# EAGLE design TRV_SX1231_V0.1b (EAGLE 6.3)
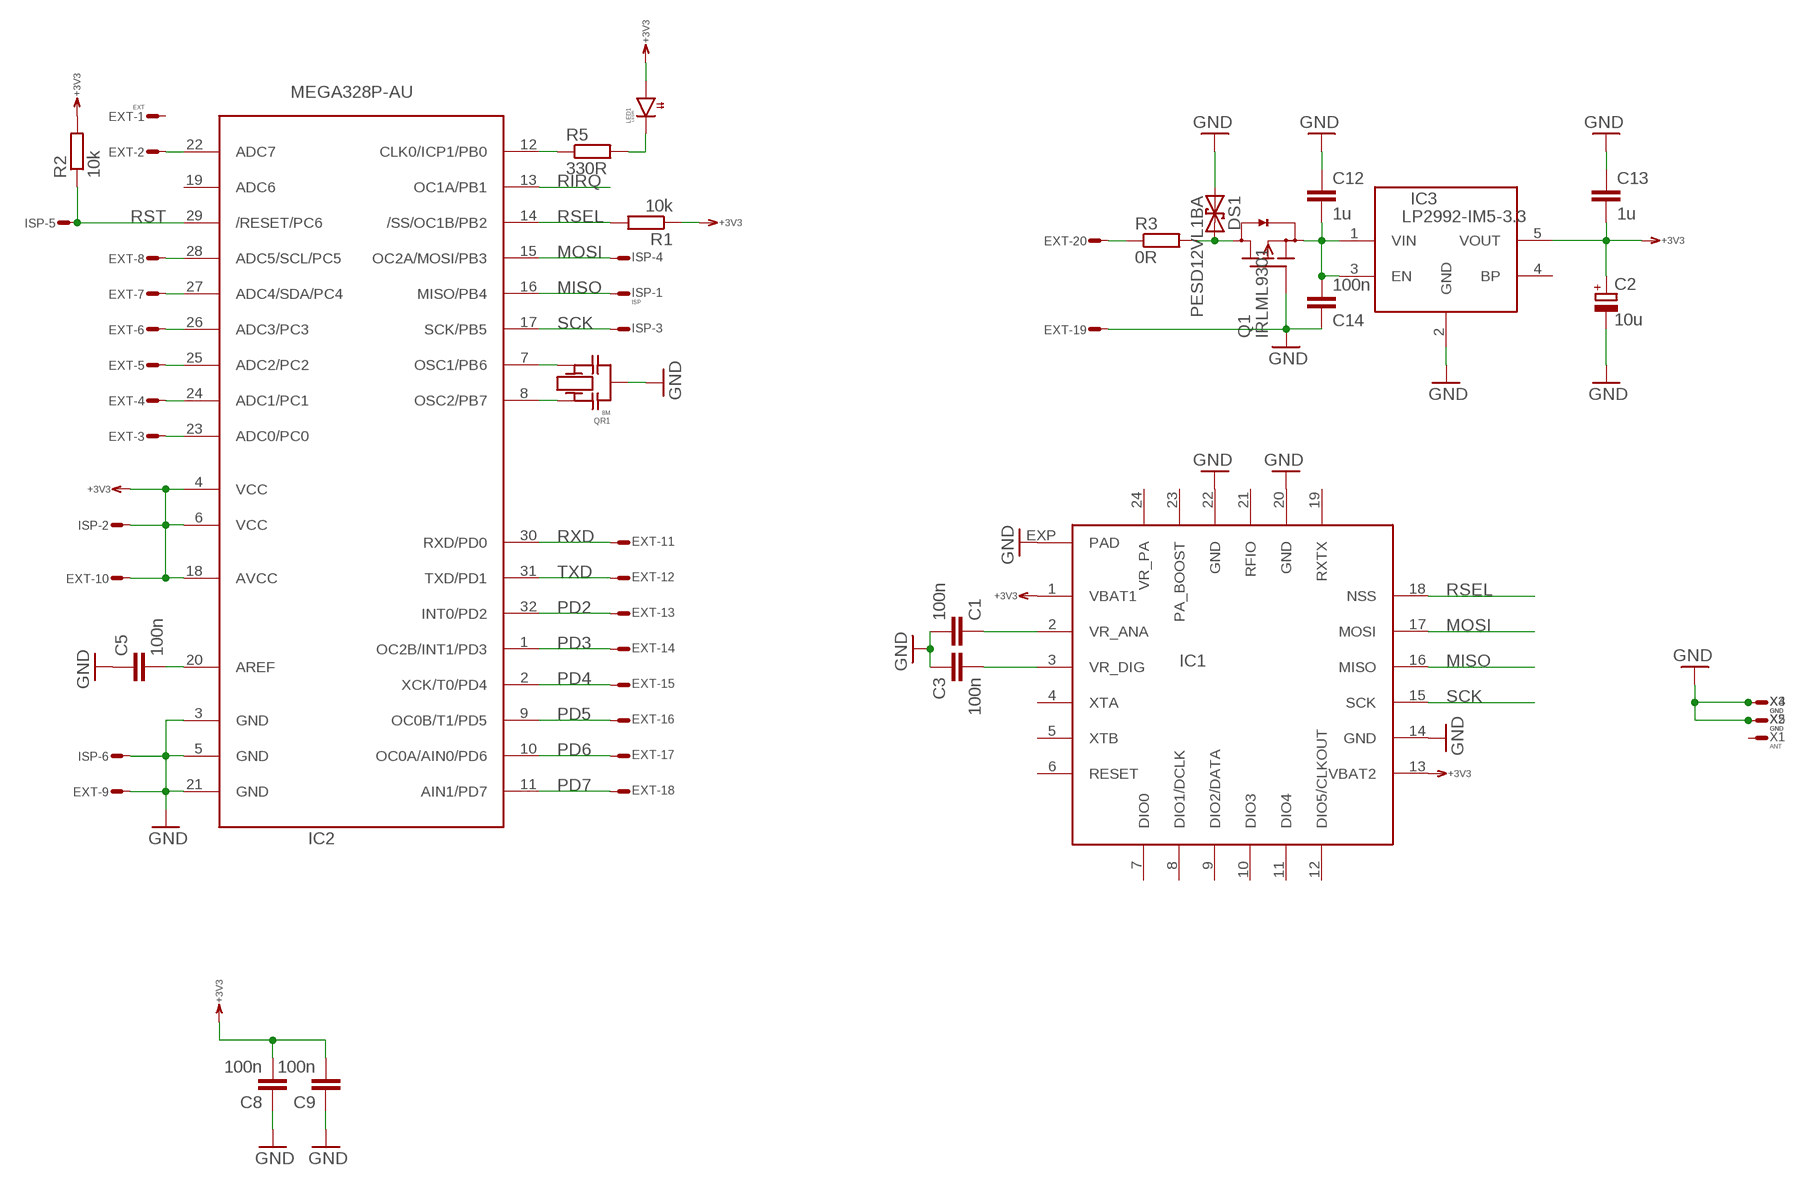
[diagram p0: schematic, sheet 1]

## Parts
C1  100n  C0603  [0603]
C2  10u  C_POLSMCB  [SMC_B]
C3  100n  C0603  [0603]
C5  100n  C0603  [0603]
C8  100n  C0603  [0603]
C9  100n  C0603  [0603]
C12  1u  C0603  [0603]
C13  1u  C0603  [0603]
C14  100n  C0603  [0603]
DS1  PESD12VL1BA  TVS-U323  [SOD323]
EXT  EXT  ML20SE  [ML20S]
IC1  SX1231  [QFN24]
IC2  MEGA328P-AU  MEGA168PA  [TQFP32-08]
IC3  LP2992-IM5-3.3  LDO  [SOT23-5]
ISP  ISP  ML6ES  [ML6S]
LED1  LEDR  LED0805  [0805]
Q1  IRLML9301  FET-PDSOT23  [SOT23]
QR1  8M  QRCR  [CR]
R1  10k  R0603  [0603]
R2  10k  R0603  [0603]
R3  0R  R0603  [0603]
R5  330R  R0603  [0603]
X1  ANT  WIREPADS2.54/1.27  [S2.54/1.27]
X2  GND  WIREPADS2.54/1.27  [S2.54/1.27]
X3  GND  WIREPADS2.54/1.27  [S2.54/1.27]
X4  GND  WIREPADS2.54/1.27  [S2.54/1.27]
X5  GND  WIREPADS2.54/1.27  [S2.54/1.27]

## Nets
+3V3: C2.+ C8.2 C9.2 C13.2 EXT.10 IC1.1(VBAT1) IC1.13(VBAT2) IC2.4(VCC) IC2.6(VCC) IC2.18(AVCC) IC3.5(VOUT) ISP.2 LED1.C(A) R1.1 R2.2
GND: C1.2 C2.- C3.1 C5.1 C8.1 C9.1 C12.1 C13.1 C14.1 DS1.A EXT.9 EXT.19 IC1.14(GND) IC1.20(GND) IC1.22(GND) IC1.EXP(PAD) IC2.3(GND) IC2.5(GND) IC2.21(GND) IC3.2(GND) ISP.6 Q1.1(G) QR1.M X2.1(S) X3.1(S) X4.1(S) X5.1(S)
MISO: IC1.16(MISO) IC2.16(MISO/PB4) ISP.1
MOSI: IC1.17(MOSI) IC2.15(OC2A/MOSI/PB3) ISP.4
N$1: C1.1 IC1.2(VR_ANA)
N$2: C3.2 IC1.3(VR_DIG)
N$3: EXT.2 IC2.22(ADC7)
N$5: DS1.C Q1.3(D) R3.2
N$6: C5.2 IC2.20(AREF)
N$7: IC2.8(OSC2/PB7) QR1.1
N$8: IC2.7(OSC1/PB6) QR1.2
N$9: EXT.20 R3.1
N$10: IC2.12(CLK0/ICP1/PB0) R5.1
N$12: C12.2 C14.2 IC3.1(VIN) IC3.3(EN) Q1.2(S)
N$21: LED1.A(C) R5.2
PC0: EXT.3 IC2.23(ADC0/PC0)
PC1: EXT.4 IC2.24(ADC1/PC1)
PC2: EXT.5 IC2.25(ADC2/PC2)
PC3: EXT.6 IC2.26(ADC3/PC3)
PC4: EXT.7 IC2.27(ADC4/SDA/PC4)
PC5: EXT.8 IC2.28(ADC5/SCL/PC5)
PD2: EXT.13 IC2.32(INT0/PD2)
PD3: EXT.14 IC2.1(OC2B/INT1/PD3)
PD4: EXT.15 IC2.2(XCK/T0/PD4)
PD5: EXT.16 IC2.9(OC0B/T1/PD5)
PD6: EXT.17 IC2.10(OC0A/AIN0/PD6)
PD7: EXT.18 IC2.11(AIN1/PD7)
RIRQ: IC2.13(OC1A/PB1)
RSEL: IC1.18(NSS) IC2.14(/SS/OC1B/PB2) R1.2
RST: IC2.29(/RESET/PC6) ISP.5 R2.1
RXD: EXT.11 IC2.30(RXD/PD0)
SCK: IC1.15(SCK) IC2.17(SCK/PB5) ISP.3
TXD: EXT.12 IC2.31(TXD/PD1)
Unconnected: EXT.1 IC1.4(XTA) IC1.5(XTB) IC1.6(RESET) IC1.7(DIO0) IC1.8(DIO1/DCLK) IC1.9(DIO2/DATA) IC1.10(DIO3) IC1.11(DIO4) IC1.12(DIO5/CLKOUT) IC1.19(RXTX) IC1.21(RFIO) IC1.23(PA_BOOST) IC1.24(VR_PA) IC2.19(ADC6) IC3.4(BP) X1.1(S)

## Library data of the parts
C1 C3 C5 C8 C9 C12-C14 = RCL:C: Capacitor SMD
C2 = RCL:C_POL: POLARIZED CAPACITOR, European symbol
DS1 = Diode:TVS-U: DIODE
EXT = Conn:ML20?E: HARTING
IC1 = RF:SX1231
IC2 = atmel:MEGA168P: MCU, 4/8/16k, TQFP32
IC3 = DCDC:LDO
ISP = Conn:ML6E: HARTING
LED1 = Optic:LED
Q1 = Transistor:FET-PD
QR1 = QUARTZ:QR
R1-R3 R5 = RCL:R: Resistor SMD
X1-X5 = Conn:WIREPAD: Wire PAD connect wire on PCB

## Board
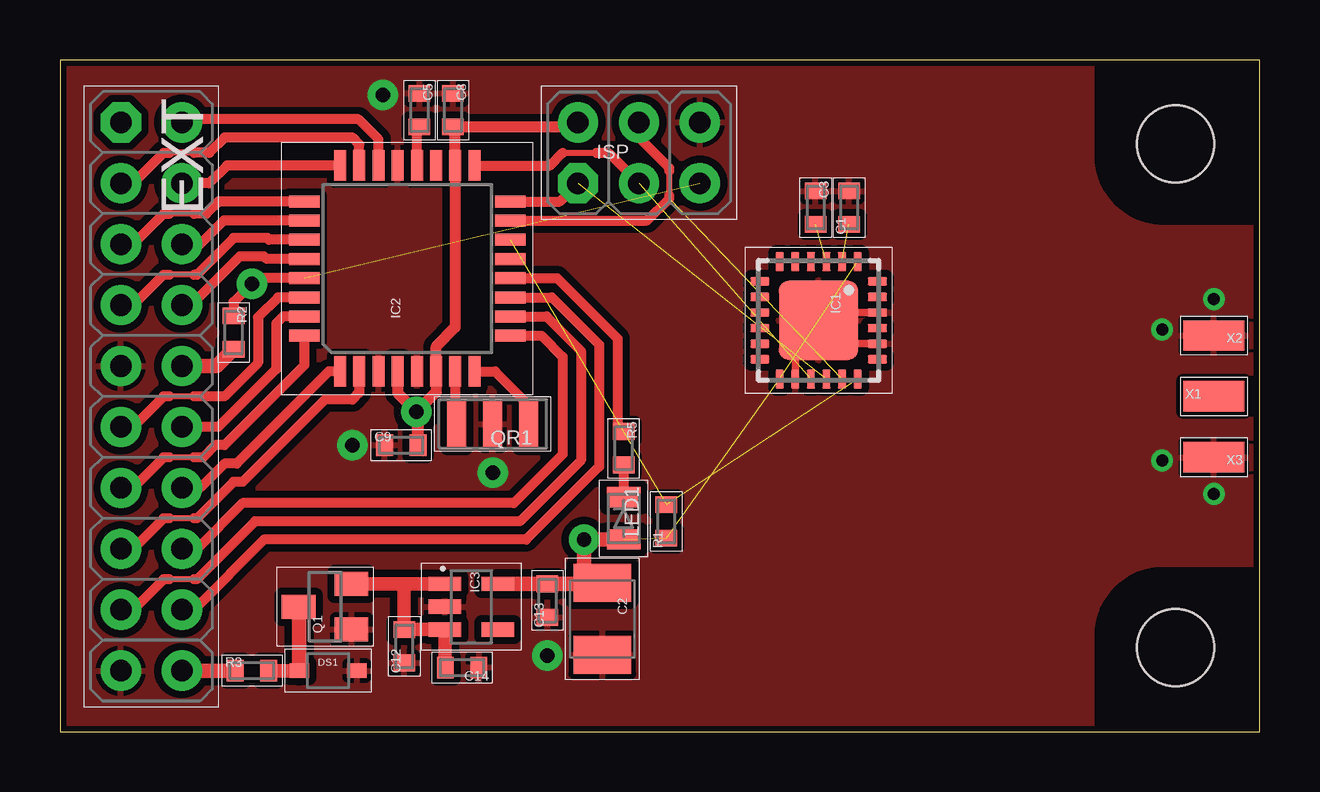
[diagram p1: board, top side]
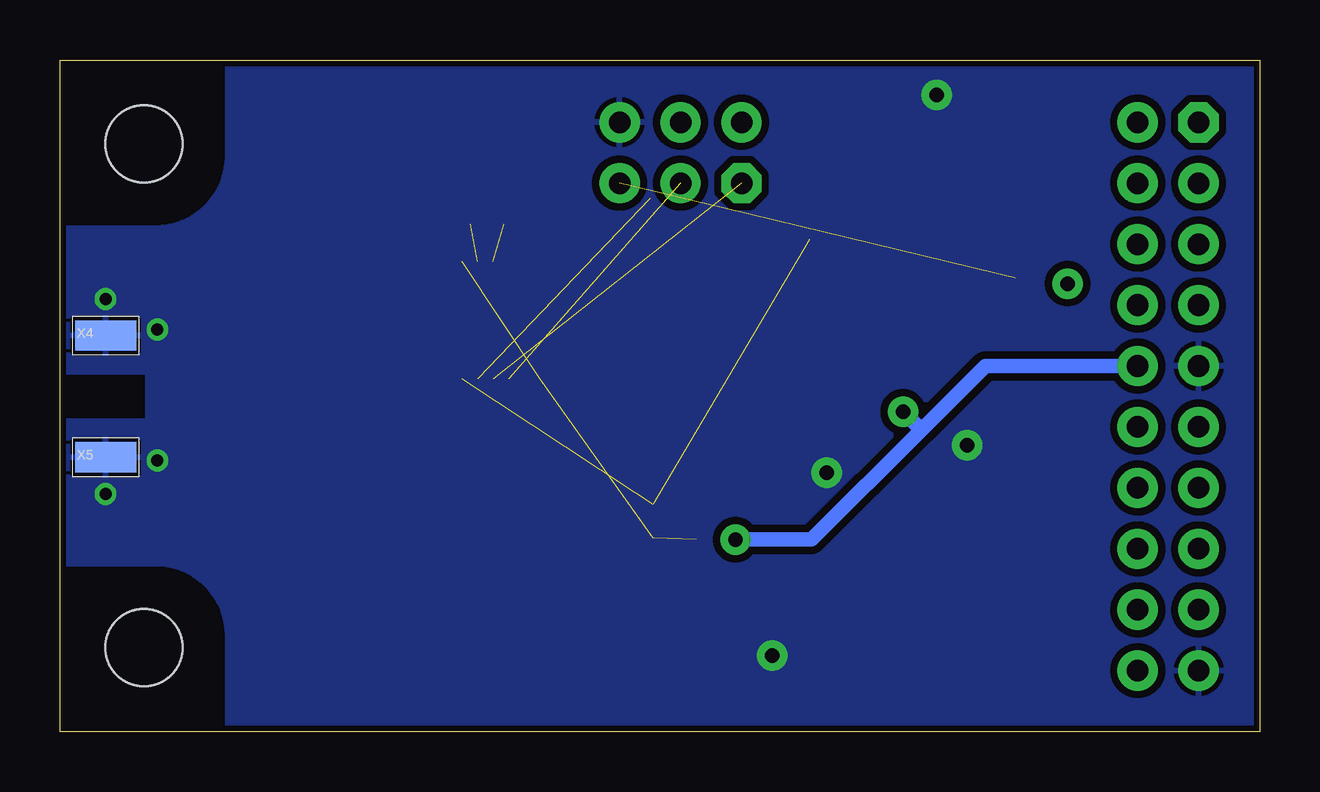
[diagram p2: board, bottom side, seen from below]

Size 50 x 28 mm. Coordinates in mm from the lower left corner, seen from the top.
Outline: 0,0 50,0 50,28 0,28 0,0
Copper layers (1*16): Top 0.035mm / dielectric 1.5mm / Bottom 0.035mm
Design rules "default *": minimum track width 8mil, minimum drill 0.3mm, track to track 12mil, track to pad 12mil, pad to pad 10mil, via to via 12mil, smd to smd 10mil, copper to edge 10mil, drill to drill 8mil, minimum pad ring 5mil, minimum via ring 8mil, stop-mask expansion 4mil, vias tented up to drill 25mil, thermal gap 8mil
Holes 3.2 mm at 46.5,24.5 46.5,3.5

### Footprints (pad centres in the part's own frame; a part is rotated, then mirrored left to right if it is on the bottom)
0603 = smd 0.7 x 0.9: 1 -0.697,0; 2 0.697,0
SMC_B = smd 1.6 x 2.4: + -1.5,0; - 1.5,0
SOD323 = smd 0.8 x 0.6: A 1.2,0; C -1.2,0
ML20S = drill 0.9 pad 1.676 octagon: 1 -11.43,-1.27 | drill 0.9 pad 1.676: 2 -11.43,1.27; 3 -8.89,-1.27; 4 -8.89,1.27; 5 -6.35,-1.27; 6 -6.35,1.27; 7 -3.81,-1.27; 8 -3.81,1.27; 9 -1.27,-1.27; 10 -1.27,1.27; 11 1.27,-1.27; 12 1.27,1.27; 13 3.81,-1.27; 14 3.81,1.27; 15 6.35,-1.27; 16 6.35,1.27; 17 8.89,-1.27; 18 8.89,1.27; 19 11.43,-1.27; 20 11.43,1.27
QFN24 = smd 0.8 x 0.35: 1 -2.45,1.625; 2 -2.45,0.975; 3 -2.45,0.325; 4 -2.45,-0.325; 5 -2.45,-0.975; 6 -2.45,-1.625; 13 2.45,-1.625; 14 2.45,-0.975; 15 2.45,-0.325; 16 2.45,0.325; 17 2.45,0.975; 18 2.45,1.625 | smd 0.35 x 0.8: 7 -1.625,-2.45; 8 -0.975,-2.45; 9 -0.325,-2.45; 10 0.325,-2.45; 11 0.975,-2.45; 12 1.625,-2.45; 19 1.625,2.45; 20 0.975,2.45; 21 0.325,2.45; 22 -0.325,2.45; 23 -0.975,2.45; 24 -1.625,2.45 | smd 3.3 x 3.3: EXP 0,0
TQFP32-08 = smd 1.27 x 0.5: 1 -4.293,2.8; 2 -4.293,2; 3 -4.293,1.2; 4 -4.293,0.4; 5 -4.293,-0.4; 6 -4.293,-1.2; 7 -4.293,-2; 8 -4.293,-2.8; 17 4.293,-2.8; 18 4.293,-2; 19 4.293,-1.2; 20 4.293,-0.4; 21 4.293,0.4; 22 4.293,1.2; 23 4.293,2; 24 4.293,2.8 | smd 0.5 x 1.27: 9 -2.8,-4.293; 10 -2,-4.293; 11 -1.2,-4.293; 12 -0.4,-4.293; 13 0.4,-4.293; 14 1.2,-4.293; 15 2,-4.293; 16 2.8,-4.293; 25 2.8,4.293; 26 2,4.293; 27 1.2,4.293; 28 0.4,4.293; 29 -0.4,4.293; 30 -1.2,4.293; 31 -2,4.293; 32 -2.8,4.293
SOT23-5 = smd 0.6 x 1.35: 1 -0.95,-1.101; 2 0,-1.101; 3 0.95,-1.101; 4 0.95,1.101; 5 -0.951,1.101
ML6S = drill 0.9 pad 1.676 octagon: 1 -2.54,-1.27 | drill 0.9 pad 1.676: 2 -2.54,1.27; 3 0,-1.27; 4 0,1.27; 5 2.54,-1.27; 6 2.54,1.27
0805 = smd 0.85 x 1.4: A 0.88,0; C -0.88,0
SOT23 = smd 1 x 1.4: 1 -0.95,-1.1; 2 0.95,-1.1; 3 0,1.1
CR = smd 0.8 x 2: 1 -1.5,0; 2 1.5,0; M 0,0
S2.54/1.27 = smd 1.27 x 2.54: 1 0,0

### Placement (x,y rotation side)
C1  32.89,21.84 90 top
C2  22.61,4.7 270 top
C3  31.5,21.84 270 top
C5  14.99,25.91 270 top
C8  16.38,25.91 270 top
C9  14.22,11.94 0 top
C12  14.35,3.56 90 top
C13  20.32,5.46 90 top
C14  16.76,2.67 180 top
DS1  11.18,2.54 0 top
EXT  3.81,13.97 270 top
IC1  31.62,17.14 270 top
IC2  14.48,19.3 90 top
IC3  17.14,5.21 270 top
ISP  24.13,24.13 0 top
LED1  23.5,8.89 90 top
Q1  11.05,5.21 90 top
QR1  18.03,12.83 180 top
R1  25.27,8.76 90 top
R2  7.24,16.64 270 top
R3  8,2.54 0 top
R5  23.5,11.81 270 top
X1  48.1,13.97 270 top
X2  48.1,16.51 90 top
X3  48.1,11.43 90 top
X4  48.1,16.51 270 bottom
X5  48.1,11.43 270 bottom

### Tracks (layer width: path | path; a pad name or v marks a point on that pad's centre or on a via)
+3V3  (via drill 0.6 pad 1.27)  (3 unrouted)
  Top 0.457: IC2.4 14.08,14.12 v14.86,13.34 15.68,14.15 IC2.6 15.68,16.06 16.48,16.86 IC2.18 16.48,25.12 C8.2 21.4,25.21 ISP.2
  Top 0.508: C9.2 14.92,13.27 v14.86,13.34
  Top 0.61: EXT.10 6.54,15.24 R2.2 | 21.97,6.16 C13.2 IC3.5 | 21.97,6.16 22.57,6.16 C2.+ | 21.97,6.16 21.84,6.29 v21.84,8 21.85,8.01 LED1.C
  Bottom 0.61: 14.1,12.57 11.43,15.24 EXT.10 | v21.84,8 18.67,8 14.1,12.57 | v14.86,13.34 14.1,12.57
GND  (via drill 0.5, 0.6 pad 1.27)
  Top 0.305: IC1.22 31.95,17.47 IC1.EXP | IC1.14 30.65,16.17 IC1.EXP | IC1.20 32.6,16.17 IC1.EXP
  other vias: 48.1,18.03 48.1,9.91 45.94,11.3 45.94,16.76 18.03,10.79 12.19,11.94 13.46,26.54 20.32,3.17
  pour Top: 0,0 43,0 43,4 arc-90 46,7 50,7 50,21 46,21 arc-90 43,24 43,28 0,28
  pour Bottom: 0,0 43,0 43,4 arc-90 46,7 50,7 50,12.95 46.32,12.95 46.32,14.99 50,14.99 50,21 46,21 arc-90 43,24 43,28 0,28
MISO  (1 unrouted)
  Top 0.406: IC2.16 20.83,22.1 ISP.1
MOSI  (1 unrouted)
  Top 0.254: 25.4,22.35 25.4,23.37
  Top 0.406: IC2.15 24.48,21.3 25.4,22.23 25.4,22.35 | 25.4,23.37 25.4,23.5 24.13,24.77 ISP.4
N$1  (1 unrouted)
N$2  (1 unrouted)
N$3
  Top 0.406: IC2.22 13.28,24.7 12.45,25.53 5.21,25.53 EXT.2
N$5
  Top 0.559: DS1.C R3.2
  Top 0.61: DS1.C 9.98,5.18 Q1.3
N$6
  Top 0.406: IC2.20 14.88,25.1 C5.2
N$7
  Top 0.406: IC2.8 18.14,15.01 19.43,13.72 19.43,12.93 QR1.1
N$8
  Top 0.406: IC2.7 16.48,12.88 QR1.2
N$9
  Top 0.61: EXT.20 R3.1
N$10
  Top 0.406: IC2.12 20.72,18.9 23.24,16.38 23.24,12.76 R5.1
N$12
  Top 0.559: IC3.1 14.35,6.16 | 14.35,6.16 Q1.2 | Q1.2 | 14.35,6.16 C12.2 IC3.3 16.04,2.69 C14.2
N$21
  Top 0.406: R5.2 LED1.A
PC0
  Top 0.254: 5.59,24.13 4.57,24.13
  Top 0.406: IC2.23 12.48,24.48 12.19,24.77 6.86,24.77 6.22,24.13 5.59,24.13 | EXT.3 3.05,22.86 4.32,24.13 4.57,24.13
PC1
  Top 0.406: IC2.24 6.96,23.6 6.22,22.86 EXT.4
PC2
  Top 0.254: 5.59,21.59 4.57,21.59
  Top 0.406: 5.59,21.59 6.1,21.59 6.61,22.1 IC2.25 | EXT.5 3.05,20.32 4.32,21.59 4.57,21.59
PC3
  Top 0.406: EXT.6 5.84,20.32 6.83,21.3 IC2.26
PC4
  Top 0.254: 5.59,19.05 4.57,19.05
  Top 0.406: 5.59,19.05 5.71,19.05 7.24,20.57 8.64,20.57 8.71,20.5 IC2.27 | EXT.7 3.05,17.78 4.32,19.05 4.57,19.05
PC5
  Top 0.406: EXT.8 5.46,17.78 7.49,19.81 8.51,19.81 8.62,19.7 IC2.28
PD2
  Top 0.254: 5.59,11.43 4.57,11.43
  Top 0.406: 4.57,11.43 4.32,11.43 3.05,10.16 EXT.13 | IC2.32 10.19,15.27 6.86,11.94 6.48,11.94 5.97,11.43 5.59,11.43
PD3
  Top 0.406: EXT.14 5.84,10.16 6.86,11.18 7.37,11.18 11.2,15.01 IC2.1
PD4
  Top 0.254: 5.59,8.89 4.57,8.89
  Top 0.406: IC2.2 12.48,14.13 12.19,13.84 11.05,13.84 7.62,10.41 7.24,10.41 5.71,8.89 5.59,8.89 | 4.57,8.89 4.32,8.89 3.05,7.62 EXT.15
PD5
  Top 0.406: IC2.9 20.07,16.5 20.95,15.62 20.95,11.56 18.92,9.53 7.62,9.53 5.71,7.62 EXT.16
PD6
  Top 0.254: 5.59,6.35 4.57,6.35
  Top 0.406: IC2.10 20.29,17.3 21.72,15.88 21.72,11.3 19.18,8.76 8.13,8.76 5.71,6.35 5.59,6.35 | 4.57,6.35 4.32,6.35 3.05,5.08 EXT.17
PD7
  Top 0.406: IC2.11 20.5,18.1 22.48,16.13 22.48,11.05 19.43,8 8.51,8 5.59,5.08 EXT.18
RSEL  (2 unrouted)
RST  (via drill 0.6 pad 1.27)  (1 unrouted)
  Top 0.406: IC2.29 8.24,18.9 v8,18.67 7.24,17.91 R2.1
RXD
  Top 0.254: 5.59,13.97 4.57,13.97
  Top 0.406: IC2.30 9.09,18.1 8.26,17.27 8.26,15.37 6.86,13.97 5.59,13.97 | 4.57,13.97 4.32,13.97 3.05,12.7 EXT.11
SCK  (1 unrouted)
  Top 0.254: 20.95,24.13 22.35,24.13
  Top 0.406: 22.35,24.13 22.86,24.13 ISP.3 | IC2.17 20.42,23.6 20.95,24.13
TXD
  Top 0.406: IC2.31 9.3,17.3 9.02,17.02 9.02,15.11 6.6,12.7 EXT.12